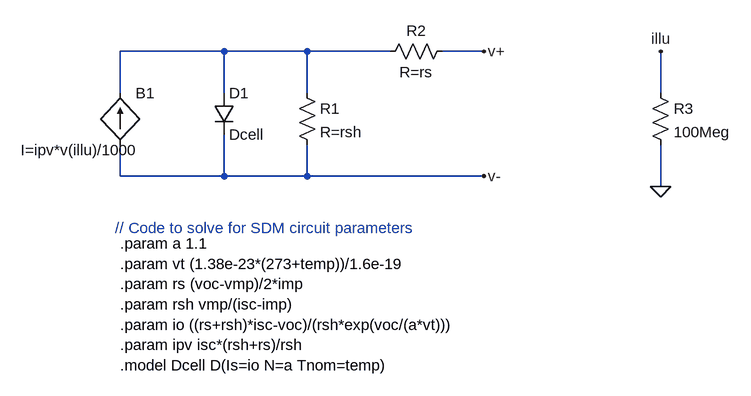
[diagram p0: schematic LTspiceModel.asc]
LTspiceModel.asc, the LTspice schematic file:
Version 4
SHEET 1 1464 680
WIRE 336 48 176 48
WIRE 464 48 336 48
WIRE 592 48 464 48
WIRE 736 48 672 48
WIRE 176 112 176 48
WIRE 336 112 336 48
WIRE 464 112 464 48
WIRE 1008 112 1008 48
WIRE 176 240 176 192
WIRE 336 240 336 176
WIRE 336 240 176 240
WIRE 464 240 464 192
WIRE 464 240 336 240
WIRE 736 240 464 240
WIRE 1008 256 1008 192
FLAG 736 48 v+
FLAG 736 240 v-
FLAG 1008 256 0
FLAG 1008 48 illu
SYMBOL bi2 176 112 R0
WINDOW 3 -153 88 Left 2
SYMATTR Value I=ipv*v(illu)/1000
SYMATTR InstName B1
SYMBOL diode 320 112 R0
SYMATTR InstName D1
SYMATTR Value Dcell
SYMBOL res 448 96 R0
SYMATTR InstName R1
SYMATTR Value R=rsh
SYMBOL res 688 32 R90
WINDOW 0 0 56 VBottom 2
WINDOW 3 32 56 VTop 2
SYMATTR InstName R2
SYMATTR Value R=rs
SYMBOL res 992 96 R0
SYMATTR InstName R3
SYMATTR Value 100Meg
TEXT 176 344 Left 2 !.param a 1.1\n.param vt (1.38e-23*(273+temp))/1.6e-19\n.param rs (voc-vmp)/2*imp\n.param rsh vmp/(isc-imp)\n.param io ((rs+rsh)*isc-voc)/(rsh*exp(voc/(a*vt)))\n.param ipv isc*(rsh+rs)/rsh\n.model Dcell D(Is=io N=a Tnom=temp)
TEXT 168 320 Left 2 ;// Code to solve for SDM circuit parameters

The netlist it stands for:
* LTspiceModel.asc
B1 v- N001 I=ipv*v(illu)/1000
D1 N001 v- Dcell
R1 N001 v- R=rsh
R2 v+ N001 R=rs
R3 illu 0 100Meg
.model D D
.lib standard.dio
.param a 1.1
.param vt (1.38e-23*(273+temp))/1.6e-19
.param rs (voc-vmp)/2*imp
.param rsh vmp/(isc-imp)
.param io ((rs+rsh)*isc-voc)/(rsh*exp(voc/(a*vt)))
.param ipv isc*(rsh+rs)/rsh
.model Dcell D(Is=io N=a Tnom=temp)
* // Code to solve for SDM circuit parameters
.backanno
.end